# Altium schematic sheet LTC2949_Top.SchDoc
size A4; SheetNumber: 1; SheetTotal: 3
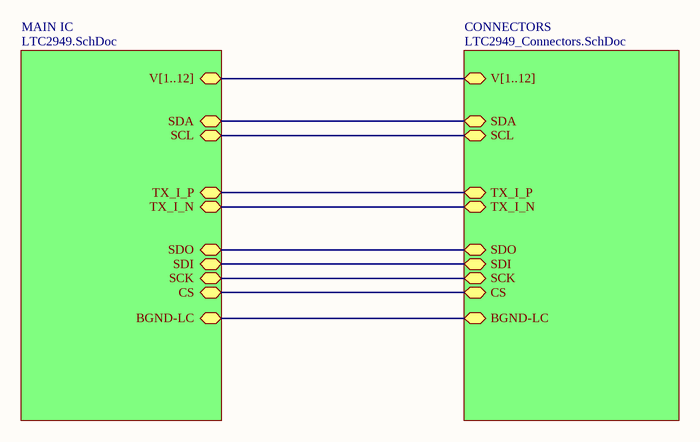
[diagram p0: LTC2949_Top.SchDoc]

## Sub-sheets
CONNECTORS = LTC2949_Connectors.SchDoc: SDA (bidir), SCL (bidir), BGND-LC (bidir), TX_I_P (bidir), TX_I_N (bidir), SDO (bidir), SDI (bidir), SCK (bidir), CS (bidir), V[1..12] (bidir)
MAIN IC = LTC2949.SchDoc: SDA (bidir), SCL (bidir), BGND-LC (bidir), TX_I_P (bidir), TX_I_N (bidir), SDO (bidir), SDI (bidir), CS (bidir), SCK (bidir), V[1..12] (bidir)

## Nets
(unnamed): sheet MAIN IC/SDA, sheet CONNECTORS/SDA
(unnamed): sheet MAIN IC/SCL, sheet CONNECTORS/SCL
(unnamed): sheet MAIN IC/BGND-LC, sheet CONNECTORS/BGND-LC
(unnamed): sheet MAIN IC/TX_I_P, sheet CONNECTORS/TX_I_P
(unnamed): sheet MAIN IC/TX_I_N, sheet CONNECTORS/TX_I_N
(unnamed): sheet MAIN IC/SDO, sheet CONNECTORS/SDO
(unnamed): sheet MAIN IC/SDI, sheet CONNECTORS/SDI
(unnamed): sheet MAIN IC/CS, sheet CONNECTORS/CS
(unnamed): sheet MAIN IC/SCK, sheet CONNECTORS/SCK

## Buses and harness runs
bus sheet CONNECTORS/V[1..12] = sheet MAIN IC/V[1..12]